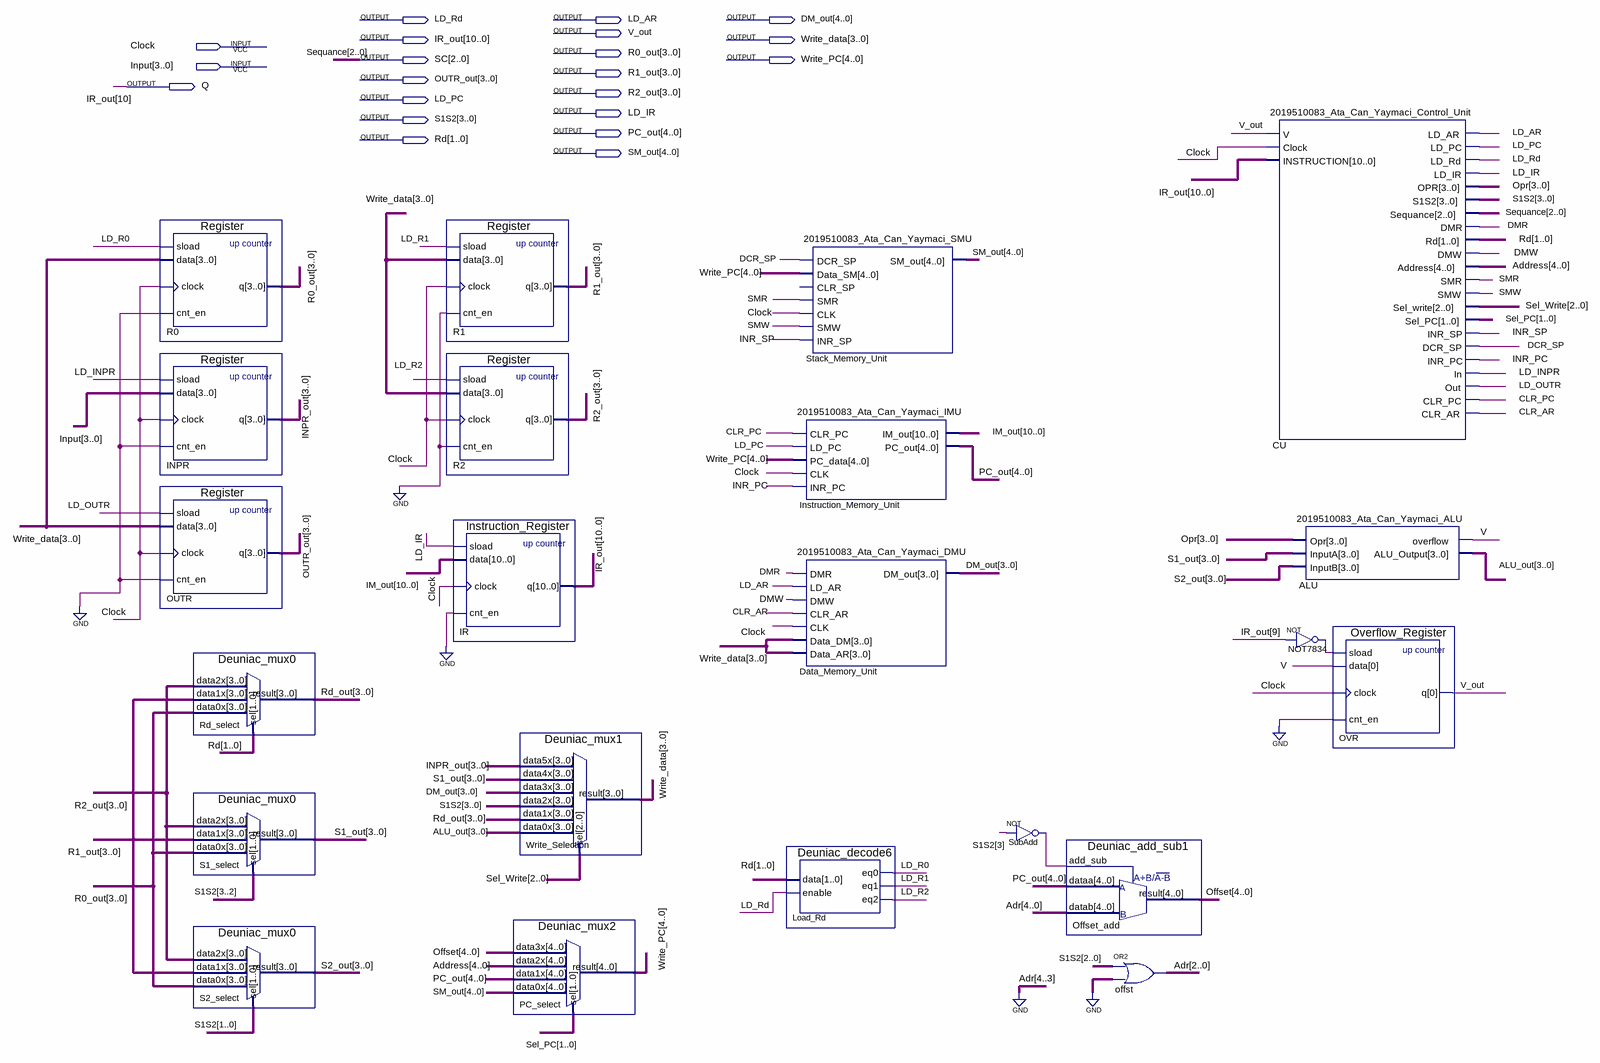
[diagram p0: schematic sheet]
// Quartus schematic 2019510083_Ata_Can_Yaymaci_Deuniac.bdf as structural Verilog: 22 symbols, 21 pins
module \2019510083_Ata_Can_Yaymaci_Deuniac  (
  input  Clock,
  input  [3:0] Input,
  output LD_Rd,
  output LD_AR,
  output [4:0] DM_out,
  output V_out,
  output [10:0] IR_out,
  output [3:0] Write_data,
  output [3:0] R0_out,
  output [2:0] SC,
  output [4:0] Write_PC,
  output [3:0] R1_out,
  output [3:0] OUTR_out,
  output Q,
  output [3:0] R2_out,
  output LD_PC,
  output LD_IR,
  output [3:0] S1S2,
  output [4:0] PC_out,
  output [1:0] Rd,
  output [4:0] SM_out
);

  wire CLR_AR, CLR_PC, DCR_SP, DMR, DMW, INR_PC, INR_SP, LD_INPR, LD_OUTR, LD_R0, LD_R1, LD_R2, NOT7834_out,
       SMR, SMW, SubAdd_out, V;
  wire [1:0] Sel_PC;
  wire [2:0] Adr, Sel_Write;
  wire [3:0] ALU_out, INPR_out, Opr, Rd_out, S1_out, S2_out;
  wire [4:0] Address, Offset;
  wire [10:0] IM_out;

  Register R0 (.sload(LD_R0), .data(Write_data), .clock(Clock), .cnt_en(1'b0), .q(R0_out));
  Register INPR (.sload(LD_INPR), .data(Input), .clock(Clock), .cnt_en(1'b0), .q(INPR_out));
  Register OUTR (.sload(LD_OUTR), .data(Write_data), .clock(Clock), .cnt_en(1'b0), .q(OUTR_out));
  Deuniac_mux0 Rd_select (.data2x(R2_out), .data1x(R1_out), .data0x(R0_out), .sel(Rd), .result(Rd_out));
  Deuniac_mux0 S1_select (.data2x(R2_out), .data1x(R1_out), .data0x(R0_out), .sel(S1S2[3:2]), .result(S1_out));
  Deuniac_mux0 S2_select (.data2x(R2_out), .data1x(R1_out), .data0x(R0_out), .sel(S1S2[1:0]), .result(S2_out));
  Register R1 (.sload(LD_R1), .data(Write_data), .clock(Clock), .cnt_en(1'b0), .q(R1_out));
  Register R2 (.sload(LD_R2), .data(Write_data), .clock(Clock), .cnt_en(1'b0), .q(R2_out));
  Instruction_Register IR (.sload(LD_IR), .data(IM_out), .clock(Clock), .cnt_en(1'b0), .q(IR_out));
  Deuniac_mux1 Write_Selection (
    .data5x(INPR_out), .data4x(S1_out), .data3x(DM_out[3:0]), .data2x(S1S2), .data1x(Rd_out),
    .data0x(ALU_out), .sel(Sel_Write), .result(Write_data));
  Deuniac_mux2 PC_select (
    .data3x(Offset), .data2x(Address), .data1x(PC_out), .data0x(SM_out), .sel(Sel_PC), .result(Write_PC));
  \2019510083_Ata_Can_Yaymaci_SMU  Stack_Memory_Unit (
    .DCR_SP(DCR_SP), .Data_SM(Write_PC), .SMR(SMR), .CLK(Clock), .SMW(SMW), .INR_SP(INR_SP), .SM_out(SM_out));  // open: CLR_SP
  \2019510083_Ata_Can_Yaymaci_IMU  Instruction_Memory_Unit (
    .CLR_PC(CLR_PC), .LD_PC(LD_PC), .PC_data(Write_PC), .CLK(Clock), .INR_PC(INR_PC), .IM_out(IM_out),
    .PC_out(PC_out));
  \2019510083_Ata_Can_Yaymaci_DMU  Data_Memory_Unit (
    .DMR(DMR), .LD_AR(LD_AR), .DMW(DMW), .CLR_AR(CLR_AR), .CLK(Clock), .Data_DM(Write_data),
    .Data_AR(Write_data), .DM_out(DM_out[3:0]));
  Deuniac_decode6 Load_Rd (.data(Rd), .enable(LD_Rd), .eq0(LD_R0), .eq1(LD_R1), .eq2(LD_R2));
  not SubAdd (SubAdd_out, S1S2[3]);
  Deuniac_add_sub1 Offset_add (.add_sub(SubAdd_out), .dataa(PC_out), .datab({2'b00, Adr}), .result(Offset));
  assign Adr = S1S2[2:0] | 3'b000;  // OR2 offst, 3 bits wide
  \2019510083_Ata_Can_Yaymaci_Control_Unit  CU (
    .V(V_out), .Clock(Clock), .INSTRUCTION(IR_out), .LD_AR(LD_AR), .LD_PC(LD_PC), .LD_Rd(LD_Rd),
    .LD_IR(LD_IR), .OPR(Opr), .S1S2(S1S2), .Sequance(SC), .DMR(DMR), .Rd(Rd), .DMW(DMW), .Address(Address),
    .SMR(SMR), .SMW(SMW), .Sel_write(Sel_Write), .Sel_PC(Sel_PC), .INR_SP(INR_SP), .DCR_SP(DCR_SP),
    .INR_PC(INR_PC), .In(LD_INPR), .Out(LD_OUTR), .CLR_PC(CLR_PC), .CLR_AR(CLR_AR));
  not NOT7834 (NOT7834_out, IR_out[9]);
  \2019510083_Ata_Can_Yaymaci_ALU  ALU (
    .Opr(Opr), .InputA(S1_out), .InputB(S2_out), .overflow(V), .ALU_Output(ALU_out));
  Overflow_Register OVR (.sload(NOT7834_out), .data(V), .clock(Clock), .cnt_en(1'b0), .q(V_out));

  assign Q = IR_out[10];

  // Other names for the same wires on the sheet: Sequance[2:0] = SC
endmodule
